# EAGLE design haccess (EAGLE 6.6.0)
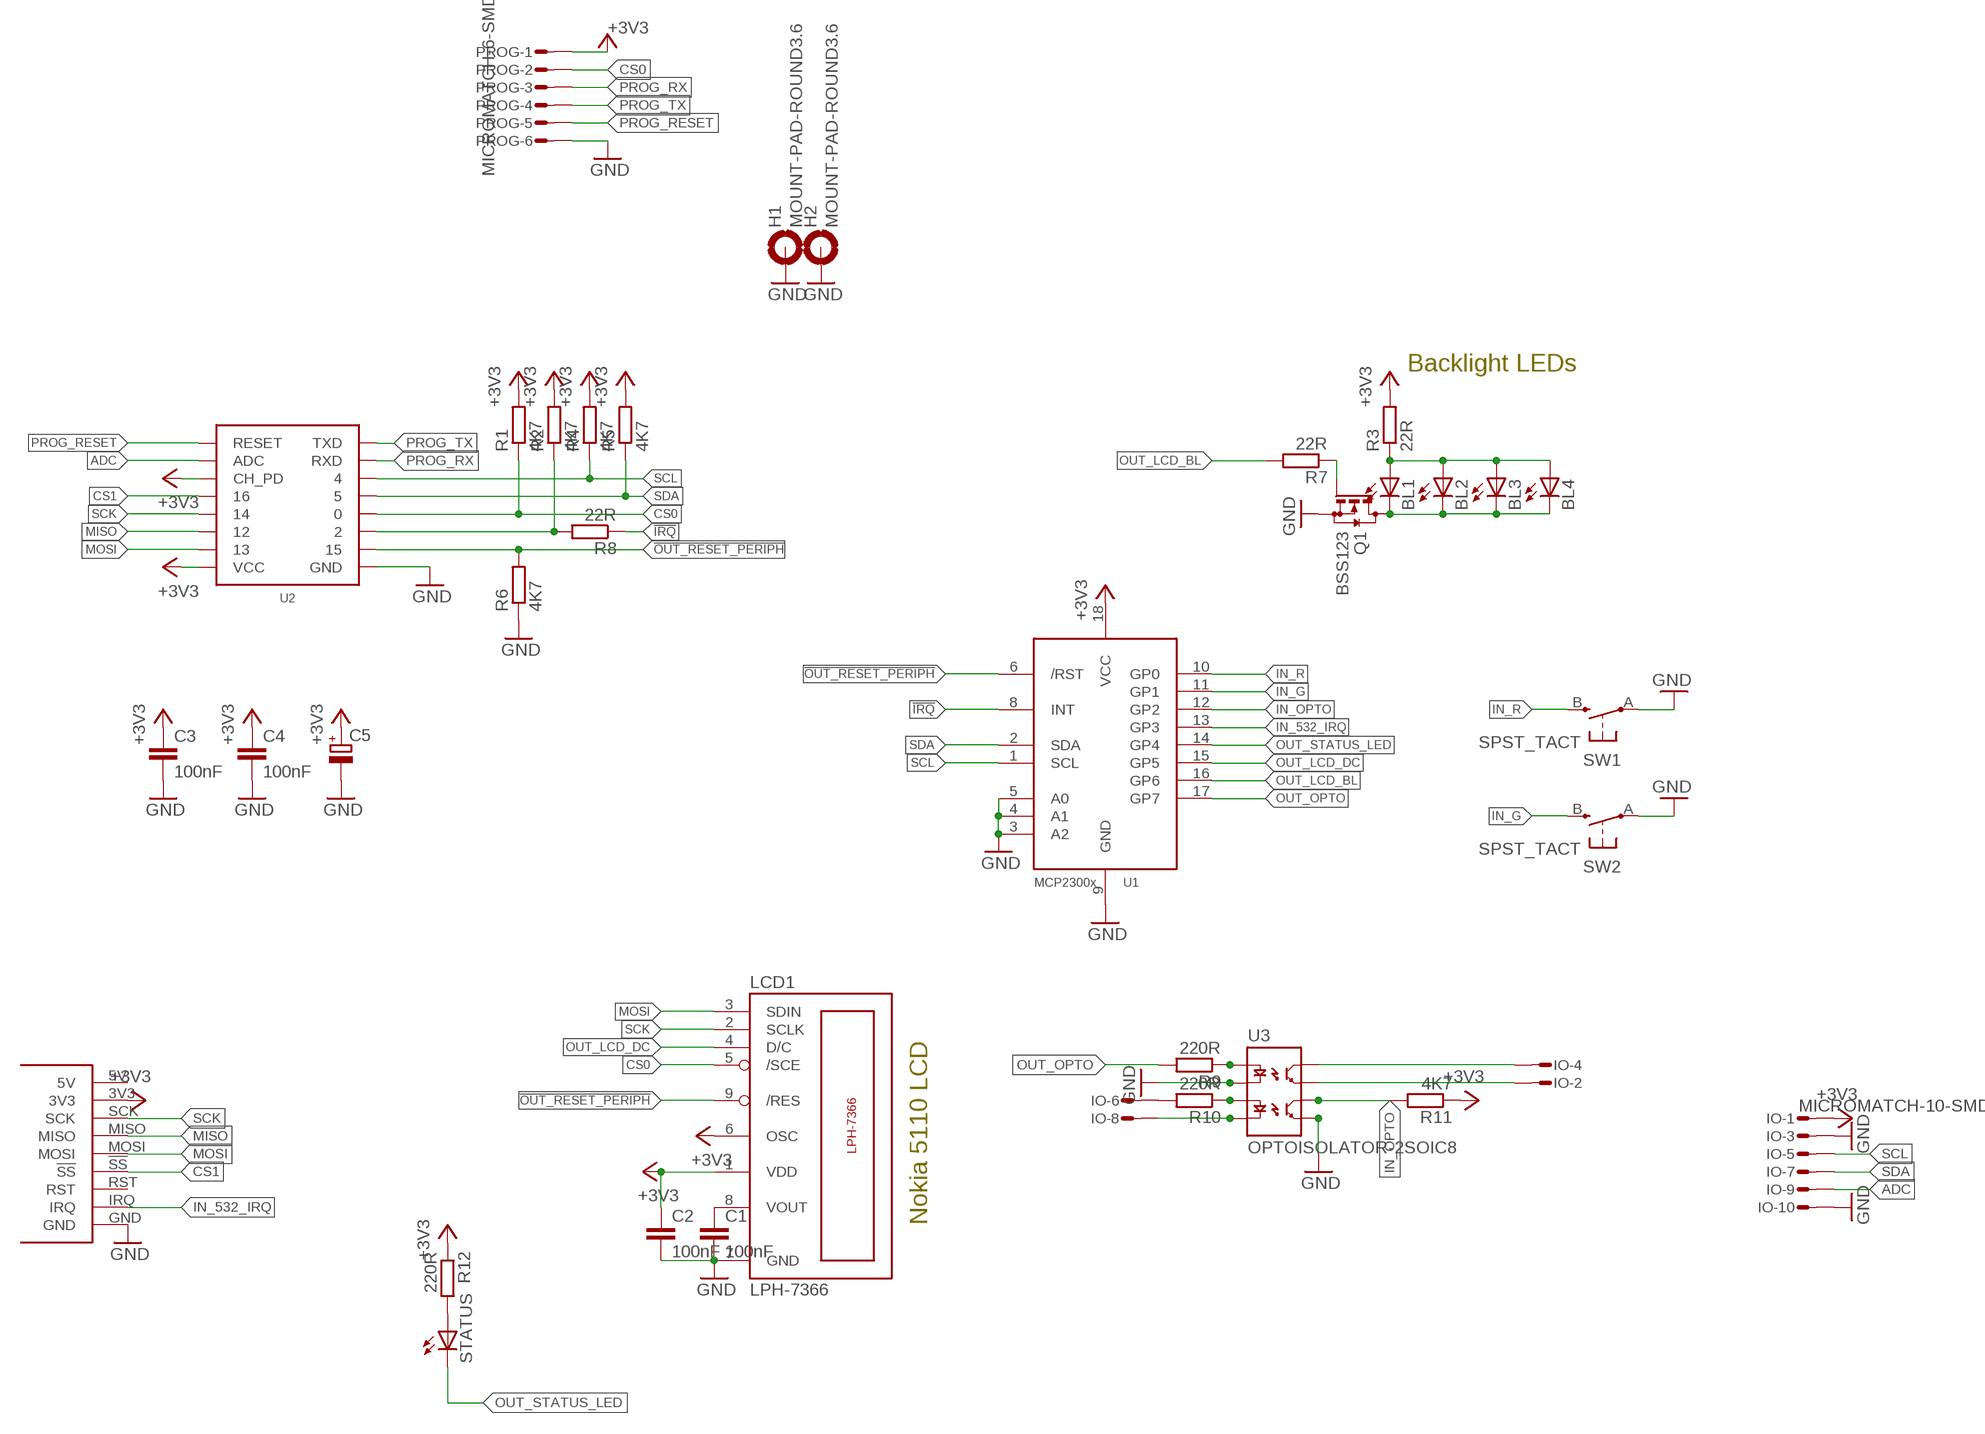
[diagram p0: schematic, sheet 1]

## Parts
BL1  LEDCHIPLED_0805  [CHIPLED_0805]
BL2  LEDCHIPLED_0805  [CHIPLED_0805]
BL3  LEDCHIPLED_0805  [CHIPLED_0805]
BL4  LEDCHIPLED_0805  [CHIPLED_0805]
C1  100nF  C-EUC0805K  [C0805K]
C2  100nF  C-EUC0805K  [C0805K]
C3  100nF  C-EUC0805K  [C0805K]
C4  100nF  C-EUC0805K  [C0805K]
C5  CPOL-EUSMCB  [SMC_B]
H1  MOUNT-PAD-ROUND3.6  [3,6-PAD]
H2  MOUNT-PAD-ROUND3.6  [3,6-PAD]
IO  MICROMATCH-10-SMD  [MICROMATCH-10-SMD]
LCD1  LPH-7366  [LPH-7366]
PROG  MICROMATCH-6-SMD  [MICROMATCH-6-SMD]
Q1  BSS123  [SOT23]
R1  4K7  R-EU_R0603  [R0603]
R2  4K7  R-EU_R0603  [R0603]
R3  22R  R-EU_R0603  [R0603]
R4  4K7  R-EU_R0603  [R0603]
R5  4K7  R-EU_R0603  [R0603]
R6  4K7  R-EU_R0603  [R0603]
R7  22R  R-EU_R0603  [R0603]
R8  22R  R-EU_R0603  [R0603]
R9  220R  R-EU_R0603  [R0603]
R10  220R  R-EU_R0603  [R0603]
R11  4K7  R-EU_R0603  [R0603]
R12  220R  R-EU_R0603  [R0603]
STATUS  LEDCHIP-LED0805  [CHIP-LED0805]
SW1  SPST_TACT  [SKPMAPE010]
SW2  SPST_TACT  [SKPMAPE010]
U1  MCP2300X/SO  [SO18W]
U2  ESP826607B  [ESP-07B]
U3  OPTOISOLATOR-2SOIC8  [SO08-2]
U$1  PN532SMALLMODULE  [SMALL-MODULE]

## Nets
!IRQ: R8.1 U1.8(INT)
!IRQ_1: R2.1 R8.2 U2.GPIO2
!OUT_RESET_PERIPH: LCD1.9(/RES) R6.2 U1.6(/RST) U2.GPIO15
+3V3 [Power]: C2.1 C3.1 C4.1 C5.+ IO.1 LCD1.1(VDD) LCD1.6(OSC) PROG.1 R1.2 R2.2 R3.2 R4.2 R5.2 R11.1 R12.1 U1.18(VCC) U2.CH_PD U2.VCC U$1.3V3
ADC: IO.9 U2.ADC
CS0: LCD1.5(/SCE) PROG.2 R1.1 U2.GPIO0
CS1: U2.GPIO16 U$1.!SS
GND: C1.2 C2.2 C3.2 C4.2 C5.- H1.B3,6(MOUNT) H2.B3,6(MOUNT) IO.3 IO.10 LCD1.7(GND) PROG.6 Q1.2(S) R6.1 SW1.A(P) SW2.A(P) U1.3(A2) U1.4(A1) U1.5(A0) U1.9(GND) U2.GND U3.2(C1) U3.5(EM2) U$1.GND
IN_532_IRQ: U1.13(GP3) U$1.IRQ
IN_G: SW2.B(S) U1.11(GP1)
IN_OPTO: R11.2 U1.12(GP2) U3.6(CL2)
IN_OPTO_A: IO.6 R10.2
IN_OPTO_C: IO.8 U3.4(C2)
IN_R: SW1.B(S) U1.10(GP0)
MISO: U2.GPIO12 U$1.MISO
MOSI: LCD1.3(SDIN) U2.GPIO13 U$1.MOSI
N$1: C1.1 LCD1.8(VOUT)
N$2 [Power]: R12.2 STATUS.A
N$3: R9.1 U3.1(A1)
N$4: R10.1 U3.3(A2)
N$8: IO.4 U3.8(CL1)
N$9: IO.2 U3.7(EM1)
N$18 [Power]: BL1.C BL2.C BL3.C BL4.C Q1.3(D)
N$19 [Power]: BL1.A BL2.A BL3.A BL4.A R3.1
N$22: Q1.1(G) R7.1
OUT_LCD_BL: R7.2 U1.16(GP6)
OUT_LCD_DC: LCD1.4(D/C) U1.15(GP5)
OUT_OPTO: R9.2 U1.17(GP7)
OUT_STATUS_LED [Power]: STATUS.C U1.14(GP4)
PROG_RESET: PROG.5 U2.RESET
PROG_RX: PROG.3 U2.RXD
PROG_TX: PROG.4 U2.TXD
SCK: LCD1.2(SCLK) U2.GPIO14 U$1.SCK
SCL: IO.5 R4.1 U1.1(SCL) U2.GPIO4
SDA: IO.7 R5.1 U1.2(SDA) U2.GPIO5
Unconnected: U$1.5V U$1.RST

## Notes on the sheet
- Backlight LEDs
- Nokia 5110 LCD

## Library data of the parts
BL1-BL4 STATUS = led:LED: LED OSRAM: - CHIPLED LG R971, LG N971, LY N971, LG Q971, LY Q971, LO R971, LY R971 LH N974, LH R974 LS Q976, LO Q976, LY Q976 LO Q996 - Hyper CHIPLED LW Q18S LB Q993, LB Q99A, LB R99A - SideLED LS A670, LO A670, LY A670, LG A670, LP A670 LB A673, LV A673, LT A673, LW A673 LH A674 LY A675 LS A676, LA A676, LO A676, LY A676, LW A676 LS A679, LY A679, LG A679 - Hyper Micro SIDELED® LS Y876, LA Y876, LO Y876, LY Y876 LT Y87S - SmartLED LW L88C, LW L88S LB L89C, LB L89S, LG L890 LS L89K, LO L89K, LY L89K LS L896, LA L896, LO L896, LY L896 - TOPLED LS T670, LO T670, LY T670, LG T670, LP T670 LSG T670, LSP T670, LSY T670, LOP T670, LYG T670 LG T671, LOG T671, LSG T671 LB T673, LV T673, LT T673, LW T673 LH T674 LS T676, LA T676, LO T676, LY T676, LB T676, LH T676, LSB T676, LW T676 LB T67C, LV T67C, LT T67C, LS T67K, LO T67K, LY T67K, LW E67C LS E67B, LA E67B, LO E67B, LY E67B, LB E67C, LV E67C, LT E67C LW T67C LS T679, LY T679, LG T679 LS T770, LO T770, LY T770, LG T770, LP T770 LB T773, LV T773, LT T773, LW T773 LH T774 LS E675, LA E675, LY E675, LS T675 LS T776, LA T776, LO T776, LY T776, LB T776 LHGB T686 LT T68C, LB T68C - Hyper Mini TOPLED® LB M676 - Mini TOPLED Santana® LG M470 LS M47K, LO M47K, LY M47K Source: http://www.osram.convergy.de LUXEON: - LUMILED® LXK2-PW12-R00, LXK2-PW12-S00, LXK2-PW14-U00, LXK2-PW14-V00 LXK2-PM12-R00, LXK2-PM12-S00, LXK2-PM14-U00 LXK2-PE12-Q00, LXK2-PE12-R00, LXK2-PE12-S00, LXK2-PE14-T00, LXK2-PE14-U00 LXK2-PB12-K00, LXK2-PB12-L00, LXK2-PB12-M00, LXK2-PB14-N00, LXK2-PB14-P00, LXK2-PB14-Q00 LXK2-PR12-L00, LXK2-PR12-M00, LXK2-PR14-Q00, LXK2-PR14-R00 LXK2-PD12-Q00, LXK2-PD12-R00, LXK2-PD12-S00 LXK2-PH12-R00, LXK2-PH12-S00 LXK2-PL12-P00, LXK2-PL12-Q00, LXK2-PL12-R00 Source: www.luxeon.com KINGBRIGHT: KA-3528ASYC Source: www.kingbright.com
C1-C4 = rcl:C-EU: CAPACITOR, European symbol
C5 = rcl:CPOL-EU: POLARIZED CAPACITOR, European symbol
H1 H2 = holes:MOUNT-PAD-ROUND: MOUNTING PAD, round
IO = tyco:MICROMATCH-10: MicroMaTch 10
LCD1 = lph-7366:LPH-7366
PROG = tyco:MICROMATCH-6: MicroMaTch 6
Q1 = transistor-small-signal:BSS123: N-CHANNEL MOS FET
R1-R12 = rcl:R-EU_: RESISTOR, European symbol
SW1 SW2 = smtswitch:SPST_TACT: SMT 6mm switch, EVQQ2 series http://www.ladyada.net/library/eagle
U1 = adafruit:MCP2300X: MCP23008 Inexpensive i2c i/o expander - 8 general purpose i/o pins with optional pullups
U2 = esp8266:ESP8266
U3 = SparkFun-DiscreteSemi:OPTOISOLATOR-2: Description: Dual gate opto isolator. Vishay part : ILD213T; PROD_ID: IC-09076
U$1 = PN532:PN532SMALLMODULE

## Net classes
0 Signal: width 0.305 mm
1 Power: width 0.61 mm, clearance 0.254 mm

## Board
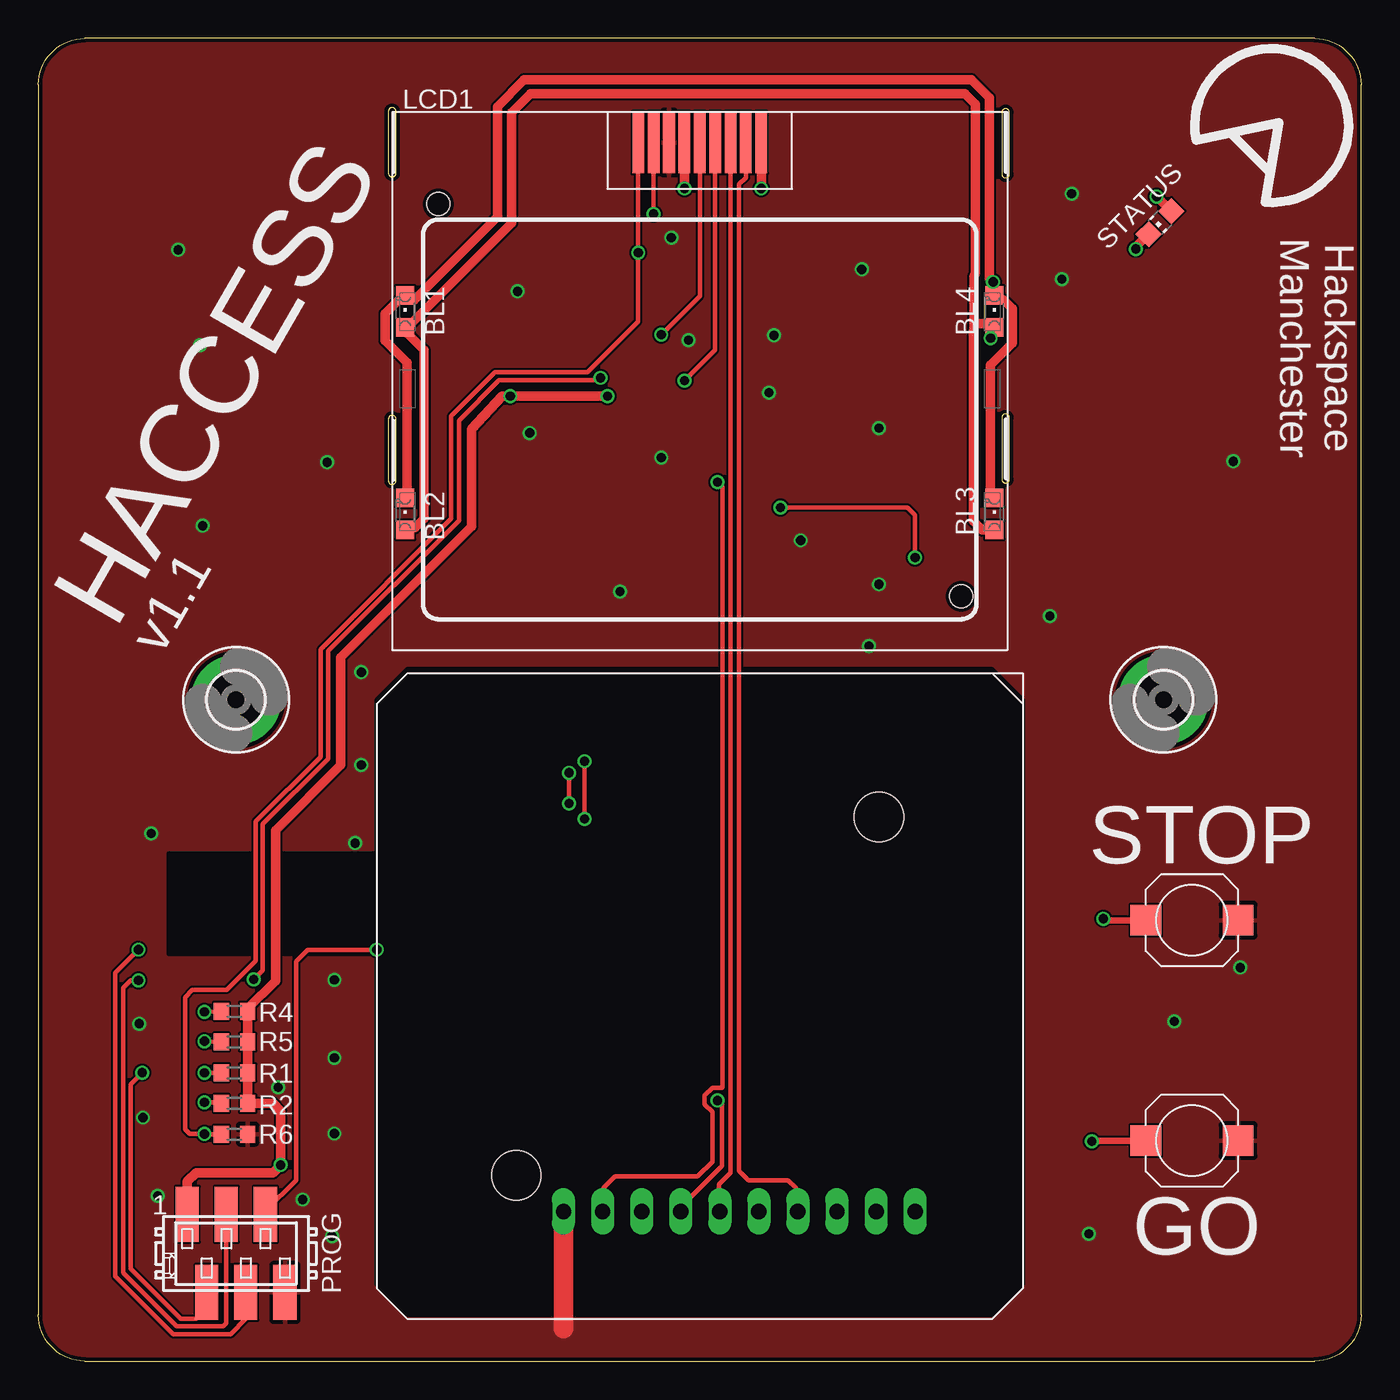
[diagram p1: board, top side]
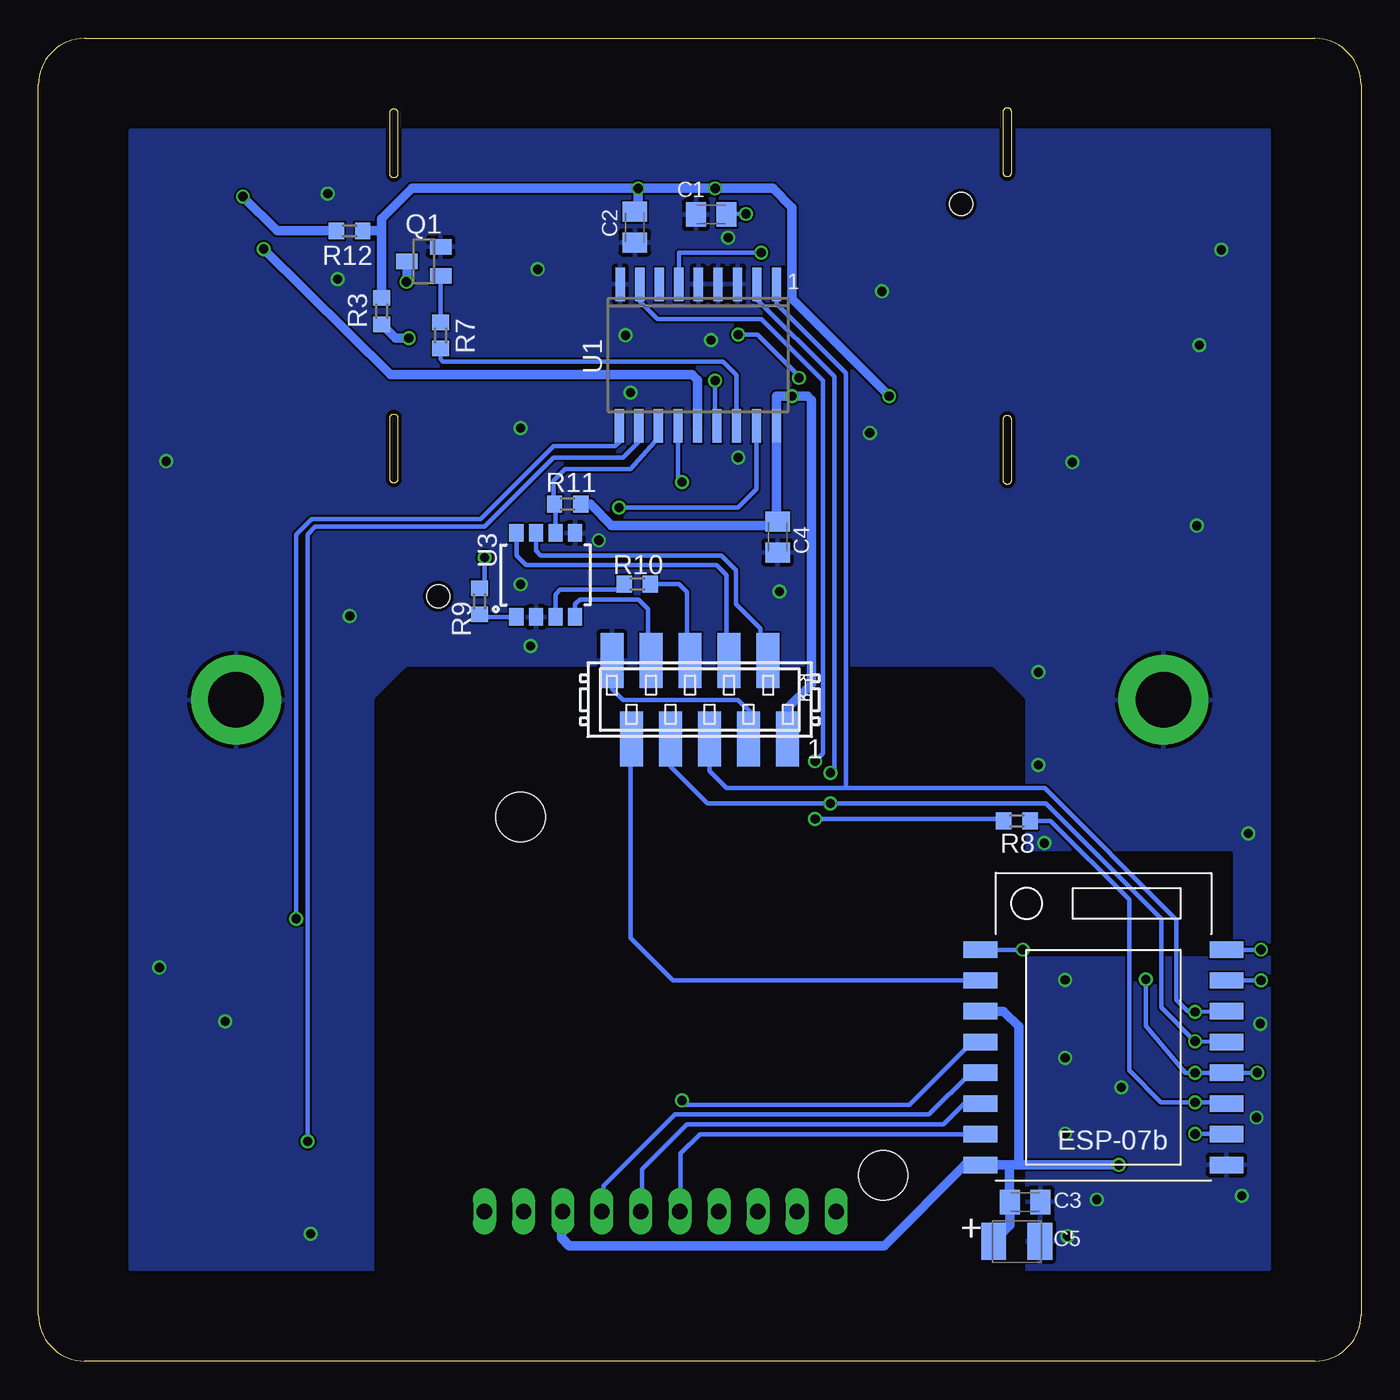
[diagram p2: board, bottom side, seen from below]

Size 86 x 86 mm. Coordinates in mm from the lower left corner, seen from the top.
Outline: 3,0 83,0 arc90 86,3 86,83 arc90 83,86 3,86 arc90 0,83 0,3 arc90 3,0
Outline: 23.25,81.25 arc90 23,81.5 arc90 22.75,81.25 22.75,77.25 arc90 23,77 arc90 23.25,77.25 23.25,81.25
Outline: 23.25,61.25 arc90 23,61.5 arc90 22.75,61.25 22.75,57.25 arc90 23,57 arc90 23.25,57.25 23.25,61.25
Outline: 62.64,77.18 arc90 62.89,76.93 arc90 63.14,77.18 63.14,81.18 arc90 62.89,81.43 arc90 62.64,81.18 62.64,77.18
Outline: 62.64,57.34 arc90 62.89,57.09 arc90 63.14,57.34 63.14,61.34 arc90 62.89,61.59 arc90 62.64,61.34 62.64,57.34
Copper layers (1*16): Top 0.035mm / dielectric 1.5mm / Bottom 0.035mm
Design rules "dirt_cheap_dirty_boards.v1": minimum track width 5mil, minimum drill 12mil, track to track 5mil, track to pad 5mil, pad to pad 5mil, via to via 5mil, smd to smd 0mil, copper to edge 10mil, drill to drill 10mil, minimum pad ring 10mil, minimum via ring 6mil, stop-mask expansion 2mil, vias tented up to drill 25mil, thermal gap 10mil
tKeepout: area 0,83 to 86,86; area 83,0 to 86,86; area 0,0 to 86,3; area 0,0 to 3,86
bKeepout: area 0,80 to 86,86; area 80,0 to 86,86; area 0,0 to 86,6; area 0,0 to 6,86
tRestrict: area 22,3 to 64,45; area 8.5,26.5 to 25,33; 4 lines
bRestrict: area 22,3 to 64,45; area 8.5,26.5 to 25,33

### Footprints (pad centres in the part's own frame; a part is rotated, then mirrored left to right if it is on the bottom)
CHIPLED_0805 = smd 1.2 x 1.2: A 0,-1.05; C 0,1.05
C0805K = smd 1.3 x 1.6: 1 -1,0; 2 1,0
SMC_B = smd 1.6 x 2.4: + -1.5,0; - 1.5,0
3,6-PAD = drill 3.6 pad 5.842: B3,6 0,0
MICROMATCH-10-SMD = smd 1.5 x 3.58: 1 5.715,-2.54; 2 4.445,2.54; 3 3.175,-2.54; 4 1.905,2.54; 5 0.635,-2.54; 6 -0.635,2.54; 7 -1.905,-2.54; 8 -3.175,2.54; 9 -4.445,-2.54; 10 -5.715,2.54
LPH-7366 = smd 0.75 x 4: 1 4,17; 2 3,17; 3 2,17; 4 1,17; 5 0,17; 6 -1,17; 7 -2,17; 8 -3,17; 9 -4,17 | hole 1.5: -17,13; 17,-12.5
MICROMATCH-6-SMD = smd 1.5 x 3.58: 1 3.175,-2.54; 2 1.905,2.54; 3 0.635,-2.54; 4 -0.635,2.54; 5 -1.905,-2.54; 6 -3.175,2.54
SOT23 = smd 1 x 1.4: 1 -0.95,-1.1; 2 0.95,-1.1; 3 0,1.1
R0603 = smd 1 x 1.1: 1 -0.85,0; 2 0.85,0
CHIP-LED0805 = smd 1.2 x 1.2: A 0,-1.05; C 0,1.05
SKPMAPE010 = smd 2 x 2: A -3,0; B 3,0
SO18W = smd 0.6 x 2.2: 1 -4.445,-4.6; 2 -3.175,-4.6; 3 -1.905,-4.6; 4 -0.635,-4.6; 5 0.635,-4.6; 6 1.905,-4.6; 7 3.175,-4.6; 8 4.445,-4.6; 9 5.715,-4.6; 10 5.775,4.6; 11 4.505,4.6; 12 3.235,4.6; 13 1.965,4.6; 14 0.695,4.6; 15 -0.575,4.6; 16 -1.845,4.6; 17 -3.145,4.6; 18 -4.445,4.6
ESP-07B = smd 2.184 x 1.067: ADC -8,-2; CH_PD -8,-4; GND 8,-14; GPIO0 8,-8; GPIO2 8,-10; GPIO4 8,-4; GPIO5 8,-6; GPIO12 -8,-10; GPIO13 -8,-12; GPIO14 -8,-8; GPIO15 8,-12; GPIO16 -8,-6; RESET -8,0; RXD 8,-2; TXD 8,0; VCC -8,-14
SO08-2 = smd 0.914 x 1.143: 1 -1.905,-2.731; 2 -0.635,-2.731; 3 0.635,-2.731; 4 1.905,-2.731; 5 1.905,2.731; 6 0.635,2.731; 7 -0.635,2.731; 8 -1.905,2.731
SMALL-MODULE = drill 1 long: 3V3 12.08,35; 5V 9.54,35; !SS 22.24,35; GND 29.86,35; IRQ 27.32,35; MISO 17.16,35; MOSI 19.7,35; NC 7,35; RST 24.78,35; SCK 14.62,35 | hole 3.2: 9.35,9.35; 32.93,32.65

### Placement (x,y rotation side)
BL1  23.84,68.25 0 top
BL2  23.84,55.09 0 top
BL3  62.16,55.09 0 top
BL4  62.16,68.25 0 top
C1  42.26,74.55 180 bottom
C2  47.23,73.72 270 bottom
C3  21.84,10.34 0 bottom
C4  37.94,53.59 270 bottom
C5  22.38,7.78 0 bottom
H1  12.85,43 0 top
H2  73.15,43 0 top
IO  43,43 0 bottom
LCD1  43,62.23 0 top
PROG  12.85,7 180 top
Q1  60.94,71.5 90 bottom
R1  12.75,18.75 0 top
R2  12.75,16.75 0 top
R3  63.69,68.27 90 bottom
R4  12.75,22.75 0 top
R5  12.75,20.75 0 top
R6  12.75,14.75 180 top
R7  59.85,66.7 270 bottom
R8  22.38,35.11 0 bottom
R9  57.32,49.41 90 bottom
R10  47.07,50.53 0 bottom
R11  51.59,55.72 180 bottom
R12  65.77,73.49 180 bottom
STATUS  72.93,74.03 135 top
SW1  75,28.67 180 top
SW2  75,14.33 180 top
U1  42.46,65.41 180 bottom
U2  16.75,26.75 0 bottom
U3  53.02,51.12 0 bottom
U$1  64,44.73 180 top

### Tracks (layer width: path | path; a pad name or v marks a point on that pad's centre or on a via)
!IRQ  (via drill 0.6)
  Top 0.305: v35.5,39 v35.5,35.25
  Bottom 0.305: U1.8 46.9,68.9 45.75,67.75 39,67.75 35,63.75 35,39.5 v35.5,39 | v35.5,35.25 23.61,35.25
  Bottom 0.406: 23.61,35.25 23.37,35.25 R8.1
!IRQ_1  (via drill 0.6)
  Top 0.305: R2.1 11.9,16.83 v10.79,16.83
  Bottom 0.305: R8.2 20.19,35.11 15.08,30 15.08,18.89 13.02,16.83 v10.79,16.83 8.83,16.83
  Bottom 0.406: 8.83,16.83 U2.GPIO2
!OUT_RESET_PERIPH  (via drill 0.6)
  Top 0.305: LCD1.9 v39,72.07 39,67.58 35.72,64.29 29.69,64.29 26.83,61.44 26.83,54.77 18.34,46.28 18.34,39.29 14.13,35.08 14.13,26.04 12.22,24.13 10,24.13 9.53,23.65 9.53,15.08 9.84,14.76 v10.79,14.76 10.64,14.75 R6.2
  Bottom 0.305: U1.6 44.36,72.07 v39,72.07 | U2.GPIO15 8.75,14.76 v10.79,14.76
+3V3  (via drill 0.6)
  Top 0.61: PROG.1 9.68,11.68 10.25,12.25 15.25,12.25 v15.75,12.75 15.75,16.25 15.25,16.75 R2.2 R1.2 R5.2 R4.2 13.6,22.92 15.41,24.73 15.41,34.5 19.66,38.75 19.66,45.75 28.16,54.25 28.16,60.59 30.16,62.75 v30.68,62.75 v37,62.75 | LCD1.1 v47,76.25 | LCD1.6 v42,76.25
  Bottom 0.61: U$1.3V3 52,9.65 52,8 51.5,7.5 31,7.5 25.75,12.75 U2.VCC 22.86,12.75 | v47,76.25 47,74.95 C2.1 | v47,76.25 v42,76.25 38.25,76.25 37,75 37,69.07 v30.68,62.75 | U2.CH_PD 23.25,22.75 22.25,21.75 22.25,12.75 | IO.1 37.28,42.47 35.75,44 35.75,62.5 36,62.75 v37,62.75 38,62.75 38,60.83 U1.18 38.01,54.82 C4.1 38.18,54.34 48.74,54.34 50.12,55.72 R11.1 | 22.25,12.75 22.86,12.75 | 22.25,12.75 v15.75,12.75 | v47,76.25 61.7,76.25 63.69,74.27 63.69,73.42 | R3.2 63.69,73.42 | C5.+ 22.84,8.82 C3.1 22.86,10.36 22.86,12.75 | 63.69,73.42 63.75,73.49 R12.1
ADC
  Bottom 0.305: U2.ADC 44.75,24.75 47.5,27.5 47.5,40.41 IO.9
CS0  (via drill 0.6)
  Top 0.305: R1.1 v10.79,18.73 | LCD1.5 43,69.25 v40.5,66.75 | v14,24.82 14.59,25.41 14.59,34.91 18.84,39.16 18.84,46.16 27.34,54.66 27.34,61.16 29.96,63.77 36.39,63.77 v36.55,63.93 | PROG.2 10.95,3.44 10.25,2.75 9.25,2.75 6,6 6,18 v6.75,18.75
  Bottom 0.305: v40.5,66.75 39.25,66.75 36.71,64.21 v36.55,63.93 | v14,24.82 14,21.79 11.44,18.75 v10.79,18.73 U2.GPIO0 v6.75,18.75
CS1  (via drill 0.6)
  Top 0.305: U$1.!SS 41.75,10 44.45,12.7 44.45,16.67 44.4,16.94 v44.16,16.94
  Bottom 0.305: U2.GPIO16 25.29,20.75 29.37,16.67 43.89,16.67 v44.16,16.94
GND  (via drill 0.6)
  Top 0.305: 34.14,2.11 34.25,2
  Top 1.27: U$1.GND 34.14,2.11
  Bottom 0.305: IO.10 48.72,43.72 48,43 40.5,43 39.75,42.25 39.75,40.53 IO.3
  other vias: 37.82,50.03 40.5,58.75 7.75,10.75 54,46.5 19.09,8.12 19.24,24.79 7.34,34.31 10.51,66.06 18.77,58.45 67.19,75.91 77.69,58.51 78.14,25.58 68.3,8.28 15.59,17.8 53.53,70.99 54.65,60.67 31.15,69.56 65.76,48.44 73.85,22.09 42.26,66.38 41.15,73.05 19.24,14.79 9.08,72.26 10.67,54.32 20.99,44.79 6.54,21.93 17.18,10.5 19.24,19.71 20.59,33.68 47.82,66.7 47.5,62.97 31.94,60.35 54.65,50.51 49.56,53.37 66.55,70.35 20.99,38.76 6.8,15.83
  pour Top: -1,87 87,87 87,-1 -1,-1
  pour Bottom: 6,80 80,80 80,6 6,6
IN_532_IRQ  (via drill 0.6)
  Top 0.305: U$1.IRQ 36.75,9.8 36.75,11.25 37.5,12 42.86,12 43.81,12.95 43.81,16.19 43.32,16.69 43.32,17.28 43.82,17.78 44.45,17.78 44.48,17.81 44.48,56.84 v44.16,57.16
  Bottom 0.305: U1.13 44.42,57.42 v44.16,57.16
IN_G  (via drill 0.6)
  Top 0.406: SW2.B 68.5,14.33 v68.5,14.28
  Bottom 0.305: U1.11 46.96,59.79 48,58.75 52.5,58.75 57,54.25 68,54.25 68.5,53.75 v68.5,14.28
IN_OPTO
  Bottom 0.305: U3.6 52.39,55.66 R11.2 52.5,55.78 52.5,57.25 51.75,58 47.5,58 45.69,60.06 U1.12
IN_OPTO_A
  Bottom 0.305: 46.22,50.66 R10.2 44.34,50.53 43.81,50.01 43.81,45.72 IO.6
IN_OPTO_C
  Bottom 0.305: 51.12,48.12 U3.4 51.12,49.21 50.8,49.53 46.99,49.53 46.35,48.9 46.35,45.72 IO.8 46.04,45.68
IN_R  (via drill 0.6)
  Top 0.406: SW1.B 69.25,28.67 v69.25,28.76
  Bottom 0.305: U1.10 48.23,59.77 48.5,59.5 52.5,59.5 57.25,54.75 68.25,54.75 69.25,53.75 69.25,29.21 v69.25,28.76
MISO
  Bottom 0.305: U$1.MISO 46.75,9.82 46.75,12.46 43.81,15.4 27.15,15.4 25.8,16.75 U2.GPIO12
MOSI
  Top 0.305: LCD1.3 45,12.25 44.25,11.5 44.25,9.78 U$1.MOSI
  Bottom 0.305: U2.GPIO13 43,14.75 44.25,13.5 44.25,9.78 U$1.MOSI
N$1  (via drill 0.6)
  Top 0.305: LCD1.8 v40,74.59
  Bottom 0.305: v40,74.59 40,74.61 C1.1
N$2  (via drill 0.6)
  Top 0.61: v72.71,75.72 v72.72,75.72 STATUS.A
  Bottom 0.61: R12.2 70.47,73.49 v72.71,75.72
N$3
  Bottom 0.305: U3.1 56.75,48.39 R9.1
N$4
  Bottom 0.305: U3.3 52.39,49.85 52.07,50.16 48.05,50.16 R10.1
N$8
  Bottom 0.305: U3.8 54.93,52.39 54.29,51.75 41.91,51.75 41.27,51.12 41.27,45.72 IO.4
N$9
  Bottom 0.305: U3.7 53.66,52.7 53.34,52.39 41.59,52.39 40.64,51.44 40.64,49.21 39.05,47.62 39.05,46.04 IO.2 38.73,45.72
N$18  (via drill 0.6)
  Top 0.61: BL2.C 24,56.07 23.97,56.2 23.97,64.93 22.54,66.36 22.54,68.1 23.5,69.06 23.9,69.22 BL1.C | BL1.C 24.19,69 | BL3.C 61.91,56.25 61.91,64.77 63.34,66.2 63.34,68.42 62.76,69 BL4.C 62.07,69.07 v62.07,70.17 61.84,70.4 61.84,82.14 60.66,83.32 31.59,83.32 29.84,81.57 29.84,74.41 24.43,69 BL1.C
  Bottom 0.61: Q1.3 62.04,70.36 v62.07,70.17
N$19  (via drill 0.6)
  Top 0.61: BL3.A 61.39,54.02 60.8,54.61 60.8,66.99 60.84,67.03 60.84,67.47 | v61.91,66.52 62,66.6 BL4.A 61.97,67.47 60.84,67.47 | BL2.A 24.5,54.18 25.08,54.77 25.08,65.72 24,66.81 BL1.A 24.25,67.5 30.75,74 30.75,81.16 32,82.41 60.25,82.41 60.93,81.73 60.93,70.75 60.84,70.5 60.84,67.47
  Bottom 0.61: v61.91,66.52 62.78,66.52 R3.1
N$22
  Bottom 0.305: Q1.1 59.84,67.41 R7.1
OUT_LCD_BL
  Bottom 0.305: U1.16 40.61,64.11 41.5,65 59.72,65 59.85,65.14 R7.2
OUT_LCD_DC  (via drill 0.6)
  Top 0.305: LCD1.4 44,65.75 v42,63.75
  Bottom 0.305: v42,63.75 42,60.93 U1.15
OUT_OPTO  (via drill 0.6)
  Top 0.305: v48.25,55.5 56.5,55.5 57,55 v57,52.25
  Bottom 0.305: U1.17 39.31,56.69 40.5,55.5 v48.25,55.5 | v57,52.25 57,50.34 R9.2
OUT_STATUS_LED  (via drill 0.6)
  Top 0.61: v71.36,72.31 71.29,72.39 STATUS.C
  Bottom 0.61: U1.14 43.15,63.79 43.5,64.14 63.1,64.14 v71.36,72.31
PROG_RESET  (via drill 0.6)
  Top 0.305: PROG.5 14.76,9.76 16.75,11.75 16.75,26 17.5,26.75 v22,26.75
  Bottom 0.305: v22,26.75 U2.RESET
PROG_RX  (via drill 0.6)
  Top 0.305: PROG.3 12.21,2.46 12,2.25 9,2.25 5.5,5.75 5.5,24.25 6,24.75 v6.5,24.75
  Bottom 0.305: v6.5,24.75 U2.RXD
PROG_TX  (via drill 0.6)
  Top 0.305: PROG.4 13.48,2.73 12.5,1.75 8.75,1.75 5,5.5 5,25.25 v6.5,26.75
  Bottom 0.305: v6.5,26.75 U2.TXD
SCK
  Top 0.305: U$1.SCK 49.25,9.86 49.25,11.25 48.75,11.75 46.18,11.75 45.56,12.37 45.56,76.52 46,76.96 LCD1.2
  Bottom 0.305: U$1.SCK 49.25,9.86 49.25,11.39 44.61,16.03 28.1,16.03 25.38,18.75 U2.GPIO14
SCL  (via drill 0.6)
  Top 0.305: R4.1 v10.79,22.7
  Bottom 0.305: U2.GPIO4 v10.79,22.7 11.25,22.75 12,23.5 12,28.68 20.57,37.25 33.5,37.25 | IO.5 42.37,38.37 41.25,37.25 33.5,37.25 | U1.1 38.01,68.76 33.5,64.25 33.5,37.25
SDA  (via drill 0.6)
  Top 0.305: R5.1 v10.79,20.8 | v34.5,38.25 v34.5,36.25
  Bottom 0.305: U2.GPIO5 v10.79,20.8 13,23 13,28.75 20.5,36.25 v34.5,36.25 42.5,36.25 44.91,38.66 IO.7 | U1.2 39.28,69.03 34.25,64 34.25,38.25 v34.5,38.25

### Text on the board
_tsilk: Hackspace / Manchester | HACCESS | v1.1 | STOP | GO
_bsilk: 1 | +